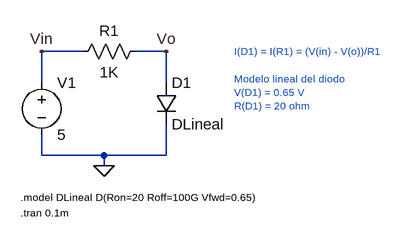
[diagram p0: schematic ejemplo_lineal.asc]
ejemplo_lineal.asc, the LTspice schematic file:
Version 4
SHEET 1 1376 680
WIRE 80 48 16 48
WIRE 208 48 160 48
WIRE 16 96 16 48
WIRE 208 96 208 48
WIRE 16 208 16 176
WIRE 112 208 16 208
WIRE 208 208 208 160
WIRE 208 208 112 208
WIRE 112 224 112 208
FLAG 112 224 0
FLAG 208 48 Vo
FLAG 16 48 Vin
SYMBOL diode 192 96 R0
SYMATTR InstName D1
SYMATTR Value DLineal
SYMBOL voltage 16 80 R0
WINDOW 123 0 0 Left 0
WINDOW 39 0 0 Left 0
SYMATTR InstName V1
SYMATTR Value 5
SYMBOL res 176 32 R90
WINDOW 0 0 56 VBottom 2
WINDOW 3 32 56 VTop 2
SYMATTR InstName R1
SYMATTR Value 1K
TEXT -16 296 Left 1 !.tran 0.1m
TEXT -16 272 Left 1 !.model DLineal D(Ron=20 Roff=100G Vfwd=0.65)
TEXT 312 48 Left 1 ;I(D1) = I(R1) = (V(in) - V(o))/R1\n \nModelo lineal del diodo\nV(D1) = 0.65 V \nR(D1) = 20 ohm

The netlist it stands for:
* ejemplo_lineal.asc
D1 Vo 0 DLineal
V1 Vin 0 5
R1 Vo Vin 1K
.model D D
.lib standard.dio
.tran 0.1m
.model DLineal D(Ron=20 Roff=100G Vfwd=0.65)
* I(D1) = I(R1) = (V(in) - V(o))/R1
* Modelo lineal del diodo
* V(D1) = 0.65 V
* R(D1) = 20 ohm
.backanno
.end